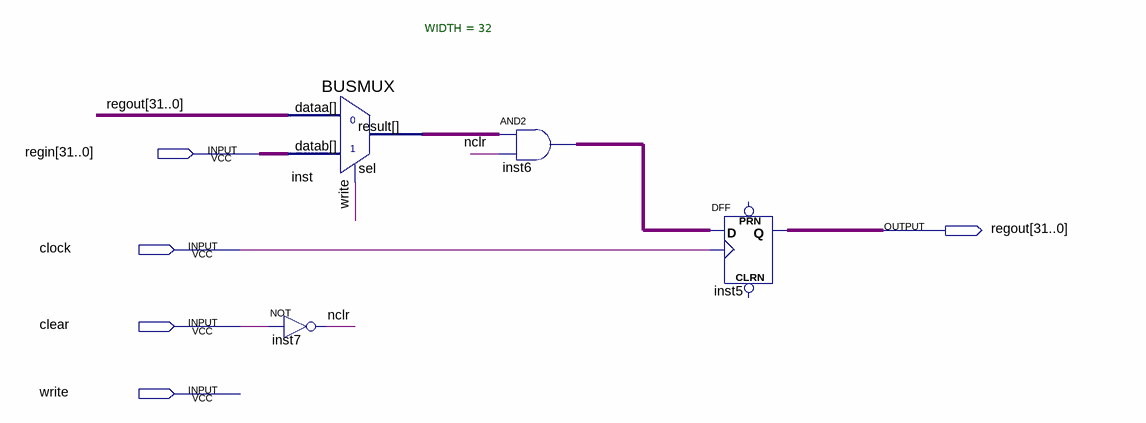
[diagram p0: schematic sheet]
// Quartus schematic Register32.bdf as structural Verilog: 4 symbols, 5 pins
module Register32 (
  input  [31:0] regin,
  input  clock,
  input  clear,
  input  write,
  output [31:0] regout
);

  wire nclr;
  wire [31:0] inst6_out, inst_result;

  not inst7 (nclr, clear);
  BUSMUX #(.WIDTH(32)) inst (.datab(regin), .sel(write), .dataa(regout), .result(inst_result));
  assign inst6_out = inst_result & {32{nclr}};  // AND2 inst6, 32 bits wide
  DFF inst5[31:0] (.CLK(clock), .D(inst6_out), .Q(regout));  // open: CLRN, PRN
endmodule
